# Altium project IndoorPositioning v1.2.PrjPcb
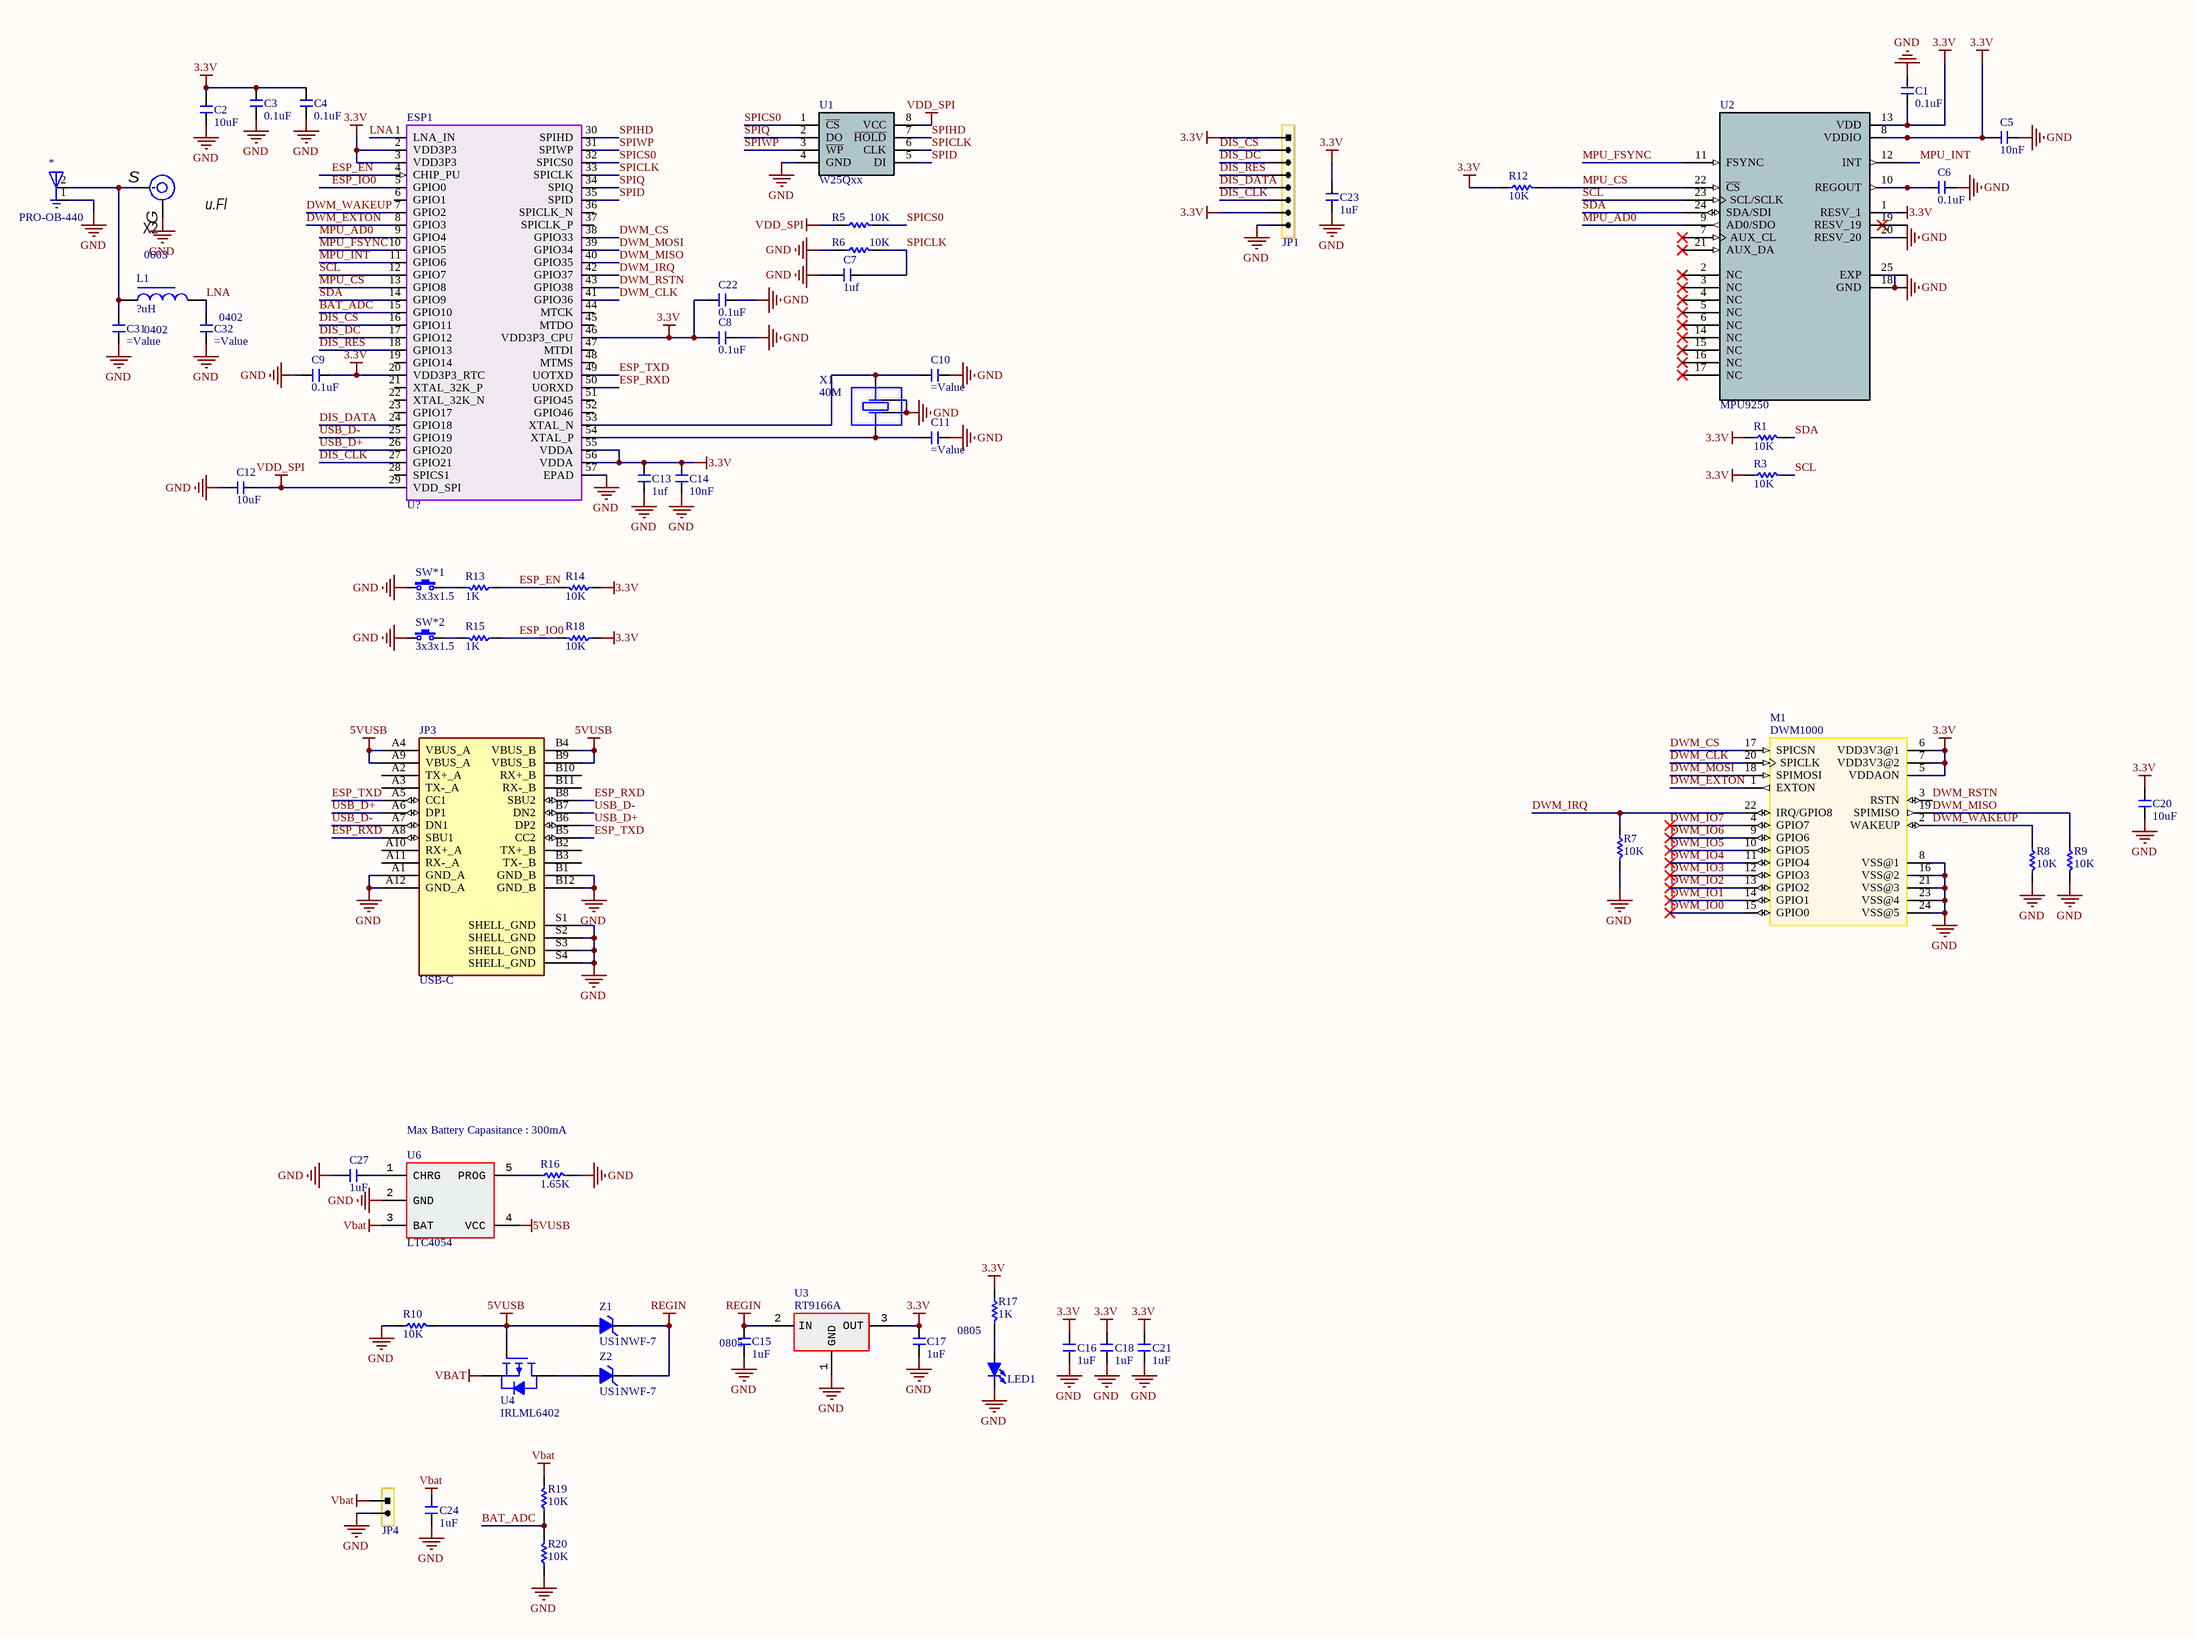
[diagram p0: Main.SchDoc]
1 sheet, 62 parts. Net scope: global (net labels, ports and power ports of the same name join across sheets).
Board file: IndoorPositioning PCB v1.2.PcbDoc

## Sheet Main.SchDoc
size A2; SheetNumber: 1; SheetTotal: 1

### Parts
*  PRO-OB-440  [PRO-OB-440]
C1  0.1uF  [C 0603]
C2  10uF  [C 0603]
C3  0.1uF  [C 0603]
C4  0.1uF  [C 0603]
C5  10nF  [C 0603]
C6  0.1uF  [C 0603]
C7  1uf  [C 0402]
C8  0.1uF  [C 0402]
C9  0.1uF  [C 0603]
C10  (no value)  [C 0402]
C11  (no value)  [C 0402]
C12  10uF  [C 0603]
C13  1uf  [C 0402]
C14  10nF  [C 0402]
C15  1uF  [C 0603]
C16  1uF  [C 0603]
C17  1uF  [C 0603]
C18  1uF  [C 0603]
C20  10uF  [C 0603]
C21  1uF  [C 0603]
C22  0.1uF  [C 0402]
C23  1uF  [C 0603]
C24  1uF  [C 0603]
C27  1uF  [C 0603]
C31  (no value)  [C 0402]
C32  (no value)  [C 0402]
ESP1  U?  [ESP32-S3 CHIP]
JP1  HDR-1X8  [HDR-1X8_M]  (value not drawn)
JP3  USB-C  [USB-C-RIGHT]
JP4  HDR-1X2  [PH2.0-2P_H]  (value not drawn)
L1  ?uH  [L 0603]
LED1  LED-SMD  [LED 0603R]  (value not drawn)
M1  DWM1000  [DWM1000]
R1  10K  [R 0603]
R3  10K  [R 0603]
R5  10K  [R 0402]
R6  10K  [R 0402]
R7  10K  [R 0603]
R8  10K  [R 0603]
R9  10K  [R 0603]
R10  10K  [R 0603]
R12  10K  [R 0603]
R13  1K  [R 0603-HP]
R14  10K  [R 0603-HP]
R15  1K  [R 0603-HP]
R16  1.65K  [R 0603]
R17  1K  [R 0603-HP]
R18  10K  [R 0603-HP]
R19  10K  [R 0603]
R20  10K  [R 0603]
SW*1  3x3x1.5  [TSW SMD-3*3]
SW*2  3x3x1.5  [TSW SMD-3*3]
U1  W25Qxx  [SOP8W_N]
U2  MPU9250  [QFN40P300X]
U3  RT9166A  [SOT89_M]
U4  IRLML6402  [SOT23-3L]
U6  LTC4054  [SOT25-5L]
X1  40M  [XTAL-3225-4]
X2  u.Fl  [u.Fl 3P]
Z1  US1NWF-7  [DO-213AA]
Z2  US1NWF-7  [DO-213AA]

### Nets
3.3V: C1.2 C2.1 C3.2 C4.1 C5.2 C8.1 C9.2 C13.1 C14.1 C16.2 C17.2 C18.2 C20.1 C21.2 C22.1 C23.1 ESP1.2(VDD3P3) ESP1.3(VDD3P3) ESP1.20(VDD3P3_RTC) ESP1.46(VDD3P3_CPU) ESP1.55(VDDA) ESP1.56(VDDA) JP1.1 JP1.7 M1.5(VDDAON) M1.6(VDD3V3@1) M1.7(VDD3V3@2) R1.1 R3.1 R12.1 R14.1 R17.1 R18.1 U2.8(VDDIO) U2.13(VDD) U3.3(OUT)
5VUSB: JP3.A4(VBUS_A) JP3.A9(VBUS_A) JP3.B4(VBUS_B) JP3.B9(VBUS_B) R10.2 U4.1(G) U6.4(VCC) Z1.1(A)
GND: *.1(GND) C1.1 C2.2 C3.1 C4.2 C5.1 C6.1 C7.1 C8.2 C9.1 C10.2 C11.2 C12.1 C13.2 C14.2 C15.1 C16.1 C17.1 C18.1 C20.2 C21.1 C22.2 C23.2 C24.1 C27.1 C31.2 C32.2 ESP1.57(EPAD) JP1.8 JP3.A1(GND_A) JP3.A12(GND_A) JP3.B1(GND_B) JP3.B12(GND_B) JP3.S1(SHELL_GND) JP3.S2(SHELL_GND) JP3.S3(SHELL_GND) JP3.S4(SHELL_GND) JP4.2 LED1.2(K) M1.8(VSS@1) M1.16(VSS@2) M1.21(VSS@3) M1.23(VSS@4) M1.24(VSS@5) R6.1 R7.2 R8.2 R9.2 R10.1 R16.2 R20.1 SW*1.1 SW*2.1 U1.4(GND) U3.1(GND) U6.2(GND) X1.2 X1.4 X2.G(GND)
REGIN: C15.2 U3.2(IN) Z1.2(K) Z2.2(K)
Vbat: C24.2 JP4.1 R19.2 U4.2(S) U6.3(BAT)
VDD_SPI: C12.2 ESP1.29(VDD_SPI) R5.1 U1.8(VCC)
BAT_ADC: ESP1.15(GPIO10) R19.1 R20.2
DIS_CLK: ESP1.27(GPIO21) JP1.6
DIS_CS: ESP1.16(GPIO11) JP1.2
DIS_DATA: ESP1.24(GPIO18) JP1.5
DIS_DC: ESP1.17(GPIO12) JP1.3
DIS_RES: ESP1.18(GPIO13) JP1.4
DWM_CLK: ESP1.41(GPIO36) M1.20(SPICLK)
DWM_CS: ESP1.38(GPIO33) M1.17(SPICSN)
DWM_EXTON: ESP1.8(GPIO3) M1.1(EXTON)
DWM_IO0: M1.15(GPIO0)
DWM_IO1: M1.14(GPIO1)
DWM_IO2: M1.13(GPIO2)
DWM_IO3: M1.12(GPIO3)
DWM_IO4: M1.11(GPIO4)
DWM_IO5: M1.10(GPIO5)
DWM_IO6: M1.9(GPIO6)
DWM_IO7: M1.4(GPIO7)
DWM_IRQ: ESP1.42(GPIO37) M1.22(IRQ/GPIO8) R7.1
DWM_MISO: ESP1.40(GPIO35) M1.19(SPIMISO) R9.1
DWM_MOSI: ESP1.39(GPIO34) M1.18(SPIMOSI)
DWM_RSTN: ESP1.43(GPIO38) M1.3(RSTN)
DWM_WAKEUP: ESP1.7(GPIO2) M1.2(WAKEUP) R8.1
ESP_EN: ESP1.4(CHIP_PU) R13.1 R14.2
ESP_IO0: ESP1.5(GPIO0) R15.1 R18.2
ESP_RXD: ESP1.50(UORXD) JP3.A8(SBU1) JP3.B8(SBU2)
ESP_TXD: ESP1.49(UOTXD) JP3.A5(CC1) JP3.B5(CC2)
LNA: C32.1 ESP1.1(LNA_IN) L1.2
MPU_AD0: ESP1.9(GPIO4) U2.9(AD0/SDO)
MPU_CS: ESP1.13(GPIO8) R12.2 U2.22(~{CS})
MPU_FSYNC: ESP1.10(GPIO5) U2.11(FSYNC)
MPU_INT: ESP1.11(GPIO6) U2.12(INT)
SCL: ESP1.12(GPIO7) R3.2 U2.23(SCL/SCLK)
SDA: ESP1.14(GPIO9) R1.2 U2.24(SDA/SDI)
SPICLK: C7.2 ESP1.33(SPICLK) R6.2 U1.6(CLK)
SPICS0: ESP1.32(SPICS0) R5.2 U1.1(~{CS})
SPID: ESP1.35(SPID) U1.5(DI)
SPIHD: ESP1.30(SPIHD) U1.7(~{HOLD})
SPIQ: ESP1.34(SPIQ) U1.2(DO)
SPIWP: ESP1.31(SPIWP) U1.3(~{WP})
USB_D+: ESP1.26(GPIO20) JP3.A6(DP1) JP3.B6(DP2)
USB_D-: ESP1.25(GPIO19) JP3.A7(DN1) JP3.B7(DN2)
Net*_2: *.2(FEED) C31.1 L1.1 X2.S(Signal)
NetC6_2: C6.2 U2.10(REGOUT)
NetC10_1: C10.1 ESP1.53(XTAL_N) X1.3
NetC11_1: C11.1 ESP1.54(XTAL_P) X1.1
NetC27_2: C27.2 U6.1(CHRG)
NetLED1_1: LED1.1(A) R17.2
NetR13_2: R13.2 SW*1.2
NetR15_2: R15.2 SW*2.2
NetR16_1: R16.1 U6.5(PROG)
NetU4_3: U4.3(D) Z2.1(A)

Not connected (* = marked no-connect by the designer): ESP1 6(GPIO1) 19(GPIO14) 21(XTAL_32K_P) 22(XTAL_32K_N) 23(GPIO17) 28(SPICS1) 36(SPICLK_N) 37(SPICLK_P) 44(MTCK) 45(MTDO) 47(MTDI) 48(MTMS) 51(GPIO45) 52(GPIO46); JP3 A2(TX+_A) A3(TX-_A) A10(RX+_A) A11(RX-_A) B2(TX+_B) B3(TX-_B) B10(RX+_B) B11(RX-_B); U2 1(RESV_1) 2(NC)* 3(NC)* 4(NC)* 5(NC)* 6(NC)* 7(AUX_CL)* 14(NC)* 15(NC)* 16(NC)* 17(NC)* 18(GND) 19(RESV_19) 20(RESV_20) 21(AUX_DA)* 25(EXP)

### Notes on the sheet
- 0603
- 0402
- (near C32) 0402
- Max Battery Capasitance : 300mA
- (near R17) 0805
- (near C15) 0805

### Library data of the parts
C1-C18 C20-C24 C27 C31 C32 = C: Non-polar patch capacitor; BOM名称: 无极性贴片电容; 版权归属: 源创客; 学习资源: www.ooocke.com
ESP1 = ESP32-S3 CHIP
JP1 = Header 8: 8P Connector; BOM名称: 8P接插件; 版权归属: 源创客; 学习资源: www.ooocke.com
JP3 = USB-C-RIGHT
JP4 = Header 2: 2P Connector; BOM名称: 2P接插件; 版权归属: 源创客; 学习资源: www.ooocke.com
L1 = L: Low power chip inductor; BOM名称: 小功率贴片电感; 版权归属: 源创客; 学习资源: www.ooocke.com
LED1 = LED-SMD: Patch LED; BOM名称: 贴片LED; 版权归属: 源创客; 学习资源: www.ooocke.com
R1 R3 R5-R10 R12-R20 = R: Chip resistor; 版权归属: 源创客; BOM名称: Chip resistor; 学习资源: www.ooocke.com
SW*1 SW*2 = TSW 3x3: 3x3 tact switch
U1 = W25Qxx: External flash; BOM名称: 外置Flash; 版权归属: 源创客; 学习资源: www.ooocke.com
U3 = RT9166A-33GXL
U4 = IRLML6402: P-Channel
U6 = LTC4054: Battery Charger; Type: SOT23-5
X1 = XTAL-4: 4-Pin crystal; BOM名称: 4脚晶振; 版权归属: 源创客; 学习资源: www.ooocke.com
X2 = u.Fl 3P: RF; Manufacturer: Hirose Electric Co Ltd; Model: U.FL-R-SMT(01); HelpURL: *; ComponentKind: *
Z1 Z2 = 1N4106: 12V/0.5W voltage regulator; BOM名称: 12V/0.5W稳压管; 版权归属: 源创客; 学习资源: www.ooocke.com